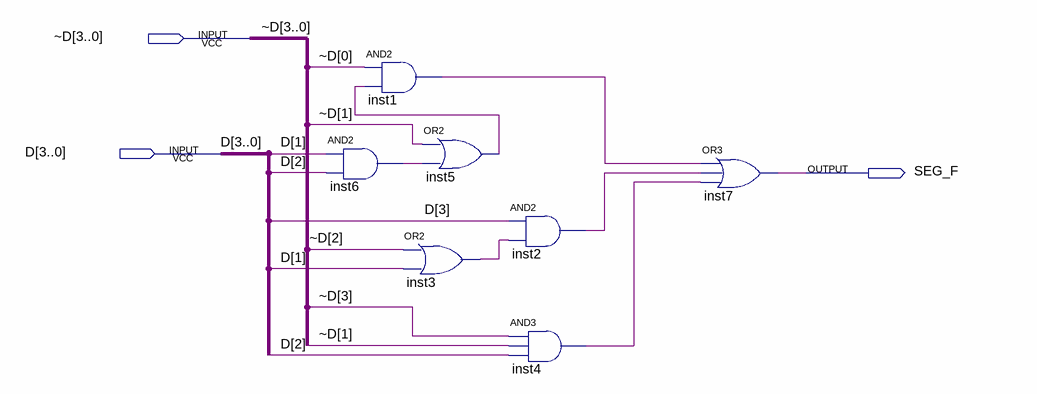
[diagram p0: schematic sheet]
// Quartus schematic SEG_F.bdf as structural Verilog: 7 symbols, 3 pins
module SEG_F (
  input  [3:0] \~D ,
  input  [3:0] D,
  output SEG_F
);

  wire inst1_out, inst2_out, inst3_out, inst4_out, inst5_out, inst6_out;

  and inst1 (inst1_out, \~D [0], inst5_out);
  and inst6 (inst6_out, D[1], D[2]);
  or inst5 (inst5_out, \~D [1], inst6_out);
  or inst3 (inst3_out, \~D [2], D[1]);
  and inst2 (inst2_out, D[3], inst3_out);
  and inst4 (inst4_out, \~D [3], \~D [1], D[2]);
  or inst7 (SEG_F, inst1_out, inst2_out, inst4_out);
endmodule
